# EAGLE design Adafruit DC Power BFF (EAGLE 9.6.2)
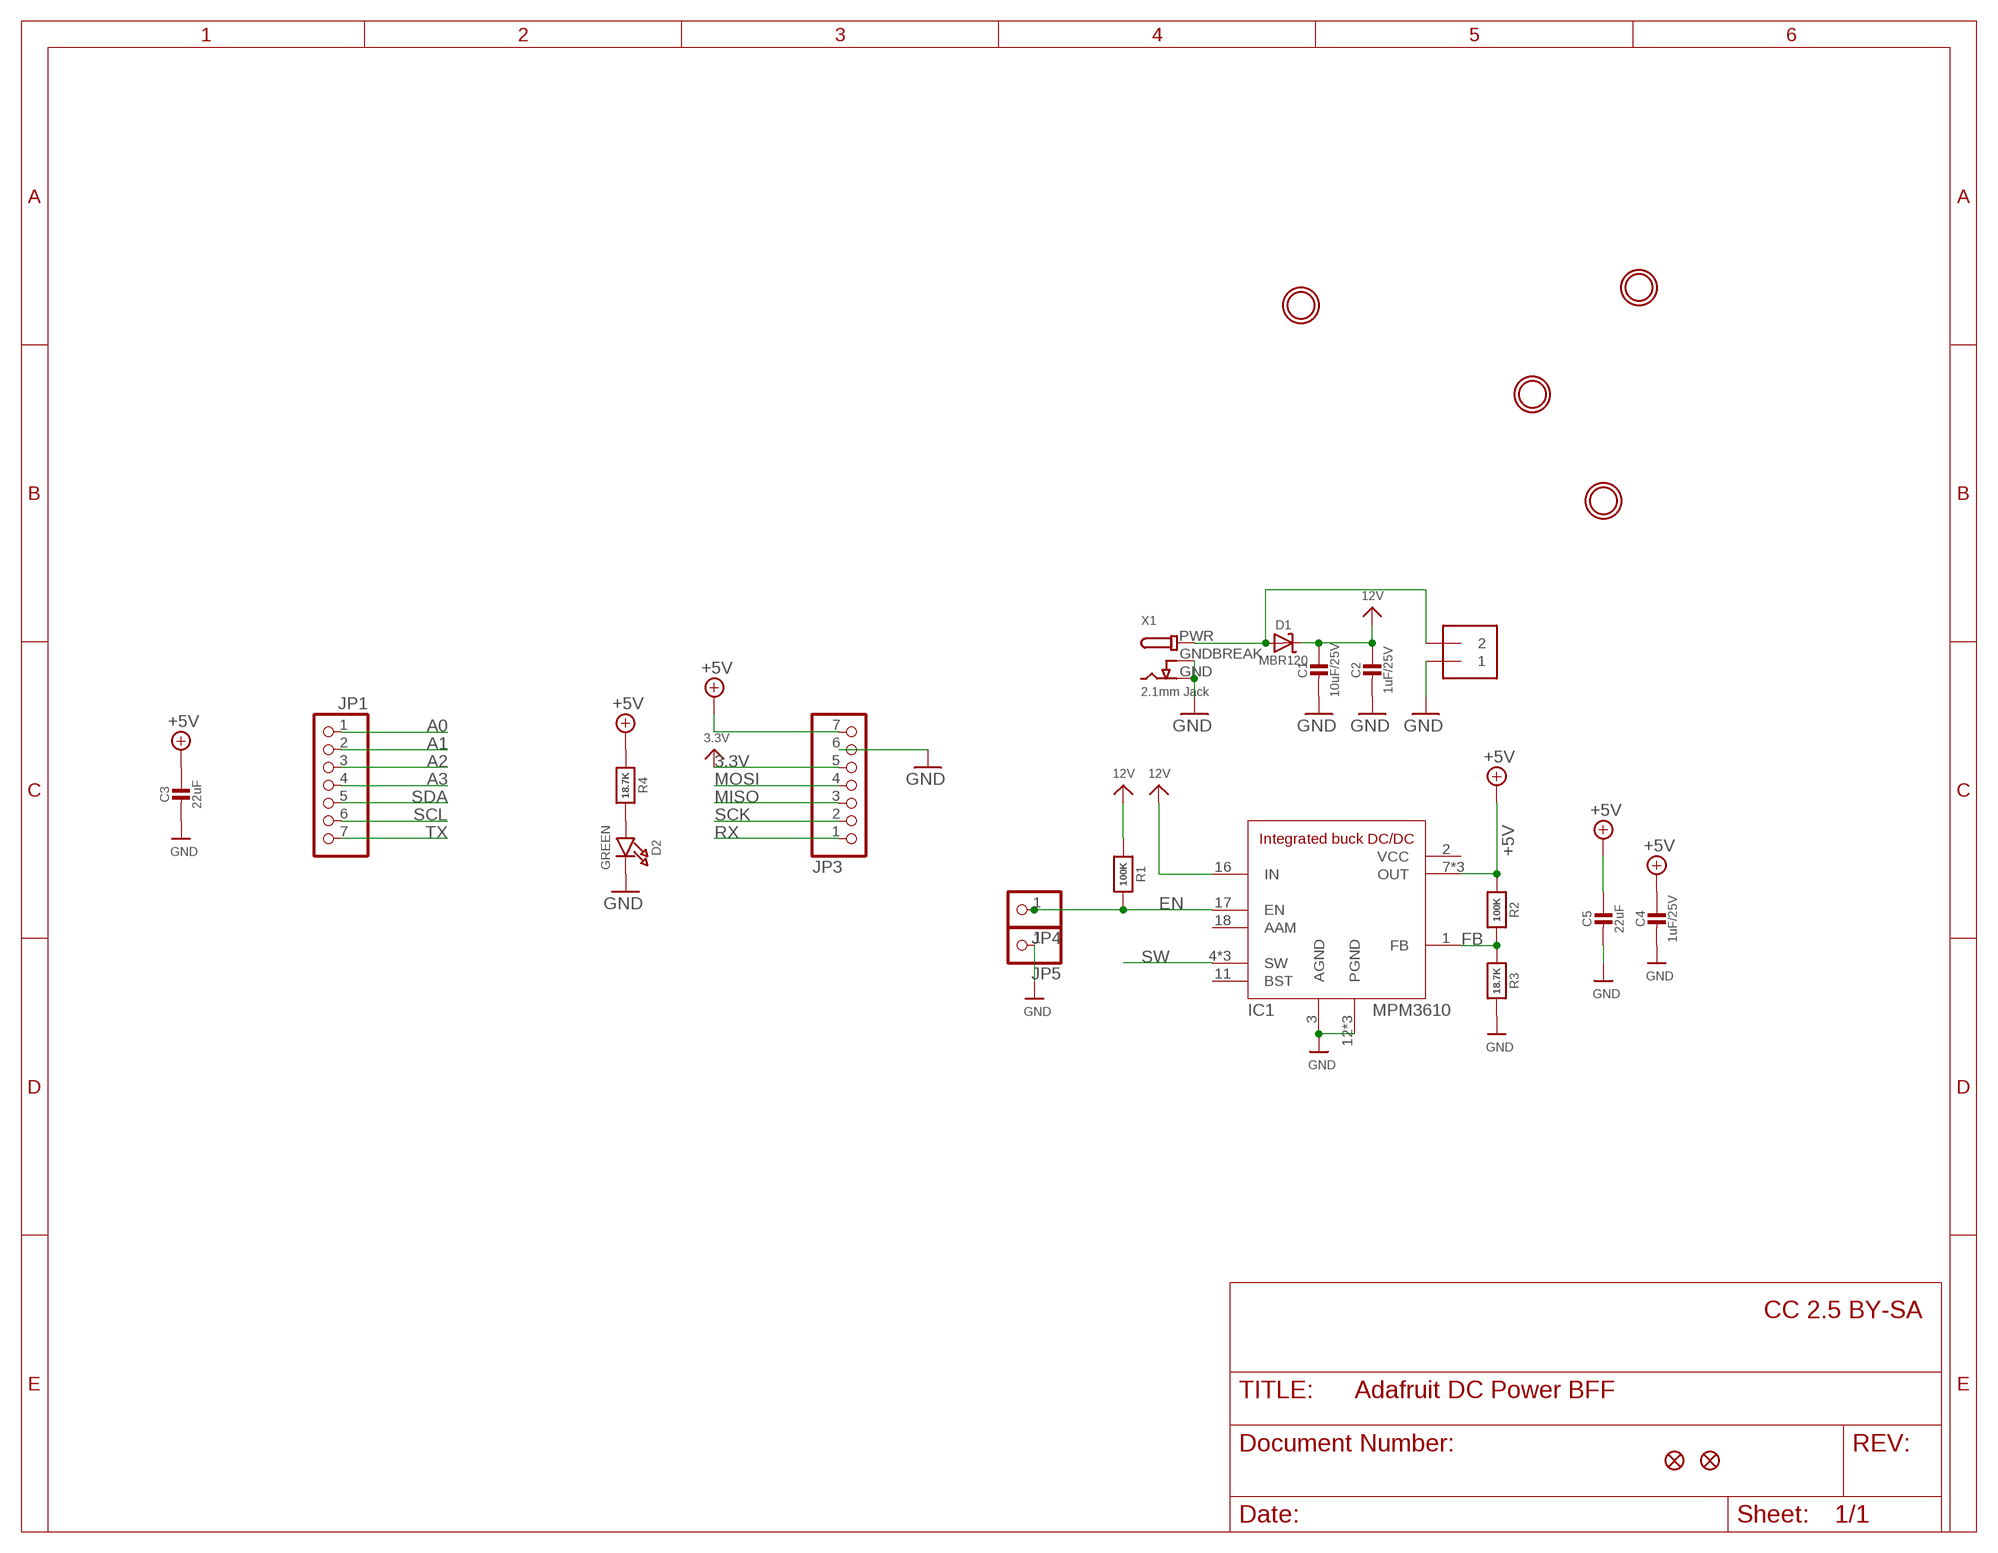
[diagram p0: schematic, sheet 1]

## Parts
C1  10uF/25V  CAP_CERAMIC0805-NOOUTLINE  [0805-NO]
C2  1uF/25V  CAP_CERAMIC0603_NO  [0603-NO]
C3  22uF  CAP_CERAMIC0805-NOOUTLINE  [0805-NO]
C4  1uF/25V  CAP_CERAMIC0603_NO  [0603-NO]
C5  22uF  CAP_CERAMIC0805-NOOUTLINE  [0805-NO]
D1  MBR120  DIODE-SCHOTTKYSOD-123FL  [SOD-123FL]
D2  GREEN  LED0603_NOOUTLINE  [CHIPLED_0603_NOOUTLINE]
IC1  MPM3610  [MPM3610]
J1  1X2-3.5MM  [1X2-3.5MM]
JP1  HEADER-1X7THICKER  [1X07_ROUND_76]
JP3  HEADER-1X7THICKER  [1X07_ROUND_76]
JP4  HEADER-1X12MM  [1X01_2MM]
JP5  HEADER-1X12MM  [1X01_2MM]
R1  100K  RESISTOR_0402NO  [_0402NO]
R2  100K  RESISTOR_0402NO  [_0402NO]
R3  18.7K  RESISTOR_0402NO  [_0402NO]
R4  18.7K  RESISTOR_0402NO  [_0402NO]
U$6  FIDUCIAL_1MM  [FIDUCIAL_1MM]
U$8  FIDUCIAL_1MM  [FIDUCIAL_1MM]
U$14  MOUNTINGHOLE2.5  [MOUNTINGHOLE_2.5_PLATED]
U$15  MOUNTINGHOLE2.5  [MOUNTINGHOLE_2.5_PLATED]
U$17  MOUNTINGHOLE2.5  [MOUNTINGHOLE_2.5_PLATED]
U$18  MOUNTINGHOLE2.5  [MOUNTINGHOLE_2.5_PLATED]
X1  2.1mm Jack  DCBARRELPTH  [DCJACK_2MM_PTH]

## Nets
3.3V: JP3.5
12V: C1.1 C2.1 D1.C IC1.16(IN) R1.1
+5V [power]: C3.1 C4.1 C5.1 IC1.7(OUT) IC1.8(OUT) IC1.9(OUT) JP3.7 R2.1 R4.1
A0: JP1.1
A1: JP1.2
A2: JP1.3
A3: JP1.4
EN: IC1.17(EN) JP4.1 R1.2
FB: IC1.1(FB) R2.2 R3.1
GND [power]: C1.2 C2.2 C3.2 C4.2 C5.2 D2.C IC1.3(AGND) IC1.12(PGND) IC1.13(PGND) IC1.14(PGND) J1.1 JP3.6 JP5.1 R3.2 X1.GND X1.GNDBREAK
MISO: JP3.3
MOSI: JP3.4
N$1: D2.A R4.2
N$2: D1.A J1.2 X1.PWR
RX: JP3.1
SCK: JP3.2
SCL: JP1.6
SDA: JP1.5
SW: IC1.4(SW) IC1.5(SW) IC1.6(SW)
TX: JP1.7
Unconnected: IC1.11(BST) IC1.18(AAM)

## Notes on the sheet
- CC 2.5 BY-SA

## Power pins joined to a net without a drawn wire
VCC: IC1.2(VCC)

## Library data of the parts
C1-C5 = microbuilder:CAP_CERAMIC: Ceramic Capacitors For new designs, use the packages preceded by an '_' character since they are more reliable: The following footprints should be used on most boards: _0402 - Standard footprint for regular board layouts _0603 - Standard footprint for regular board layouts _0805 - Standard footprint for regular board layouts _1206 - Standard footprint for regular board layouts For extremely tight-pitch boards where space is at a premium, the following 'micro-pitch' footprints can be used (smaller pads, no silkscreen outline, etc.): _0402MP - Micro-pitch footprint for very dense/compact boards _0603MP - Micro-pitch footprint for very dense/compact boards _0805MP - Micro-pitch footprint for very dense/compact boards _1206MP - Micro-pitch footprint for very dense/compact boards
D1 = microbuilder:DIODE-SCHOTTKY
D2 = microbuilder:LED: LED 0603 - 0603 Surface Mount Package 2mA: Green LED - Low Power (3.9mcd, 2ma, 1.7Vf) - Digikey: 475-2709-2-ND Orange LED - Low Power (9.8mcd, 2ma, 1.8Vf) - Digikey: 475-1194-2-ND Red LED - Low Power (5mcd, 2ma, 1.8Vf) - Digikey: 475-1195-2-ND Yellow LED - Low Power (7mcd, 2ma, 1.8Vf) - Digikey: 475-1196-2-ND 5mA: Blue LED - Low Power (17mcd, 5ma, 2.9Vf) - Digikey: LNJ937W8CRACT-ND 0805 - 0805 Surface Mount Package 2mA: Red LED (8.8mcd, 2mA, 1.8Vf, Clear) - Low Power [Digikey: 475-2510-1-ND] Green LED (5mcd, 2mA, 1.8Vf, Clear) - Low Power [Digikey: 475-2730-1-ND] Yellow LED (11.3mcd, 2mA, 1.8Vf, Clear) - Low Power [Digikey: 475-2555-1-ND] 20mA: Red LED (104mcd, 20mA, Diffused) - LS R976 [Digikey: 475-1278-6-ND] Red LED (12mcd, 20mA, 2.0Vf, Clear) - APT2012EC [Digikey: 754-1128-1-ND] Green LED (15mcd, 20mA, 2.2Vf, Clear) - APT2012GC [Digikey: 754-1131-1-ND] Orange LED (160mcd, 20mA, 2.1Vf, Clear) - APT2012SECK [Digikey: 754-1130-1-ND] 1206 - 1206 Surface Mount Package Green LED (26mcd, 20mA, Diffused) - LG N971 [Digikey: 475-1407-6-ND] Red LED (15mcd, 20mA, Diffused) - LH N974 [Digikey: 475-1416-6-ND] Cree - Cree High-Power Surface Mount LEDs XPEBWT-L1-0000-00D50 - White 111lm 350mA 2.9Vf 6200K 110° XTEAWT-00-0000-00000LEE3 - White 114lm 350mA 2.85Vf 5000K 115° Everlight - Everlight 45-21 Series Surface Mount LEDs 45-21/QK2C-B2832AC2CB2/2T - Warm White 2000mcd 20mA 3.25Vf 3050K 120° 45-21/LK2C-B38452C4CB2/2T - Nuetral White 2000mcd 20mA 3.25Vf 4150K 120° 45-21/LK2C-B50634C6CB2/2T - Cold White 2200mcd 20mA 3.25Vf 5650K 120° PLCC2 Reverse Mount LS T77K-J1L2-1-0-2-R18-Z - Red 11.25mcd 2mA 1.8Vf 630nm 120° LO T77K-L1M2-24-Z - Orange 19.6mcd 2mA 1.8Vf 606nm 120° LY T77K-K2M1-26-Z - Yellow 15.7mcd 2mA 1.8Vf 587nm 120°; ROT: 270
IC1 = microbuilder:MPM3610
J1 = adafruit:1X2: 3.5mm Terminal block http://www.ladyada.net/library/pcb/eaglelibrary.html
JP1 JP3 = adafruit_electromech:HEADER-1X7: PIN HEADER
JP4 JP5 = microbuilder:HEADER-1X1: PIN HEADER
R1-R4 = microbuilder:RESISTOR: Resistors For new designs, use the packages preceded by an '_' character since they are more reliable: The following footprints should be used on most boards: _0402 - Standard footprint for regular board layouts _0603 - Standard footprint for regular board layouts _0805 - Standard footprint for regular board layouts _1206 - Standard footprint for regular board layouts For extremely tight-pitch boards where space is at a premium, the following 'micro-pitch' footprints can be used (smaller pads, no silkscreen outline, etc.): _0402MP - Micro-pitch footprint for very dense/compact boards _0603MP - Micro-pitch footprint for very dense/compact boards _0805MP - Micro-pitch footprint for very dense/compact boards _1206MP - Micro-pitch footprint for very dense/compact boards
U$6 U$8 = microbuilder:FIDUCIAL: Fiducial Alignment Points Various fiducial points for machine vision alignment.; BOM: EXCLUDE
U$14 U$15 U$17 U$18 = adafruit_electromech:MOUNTINGHOLE: Mounting Hole For #2 screws (0.086"/2.18mm width, 0.094"/2.4mm hole) use 2.5mm; BOM: EXCLUDE
X1 = adafruit_electromech:DCBARREL: DC Barrel Jack DCJACK_1.3MM_PTH - Through Hole 1.3mm Jack (4UConnector: 05536) DCJACK_2MM_PTH - Through Hole 2.0/2.1 Jack (4UConnector: 05537) DCJACK_2MM_SMT - SMT 2.0/2.1mm Jack(4UConnector: 03267)

## Net classes
1 power: width 0.305 mm
2 thickpower: width 0.406 mm

## Board
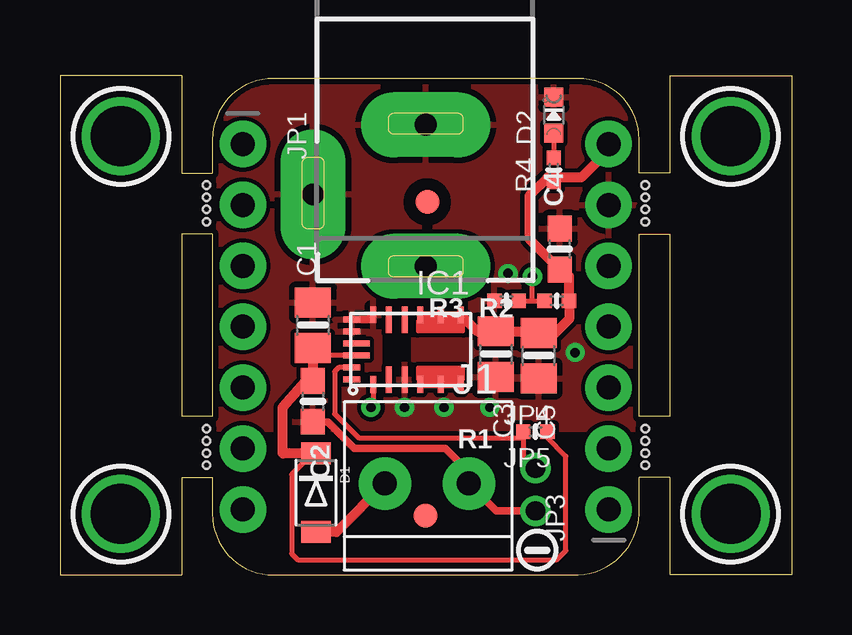
[diagram p1: board, top side]
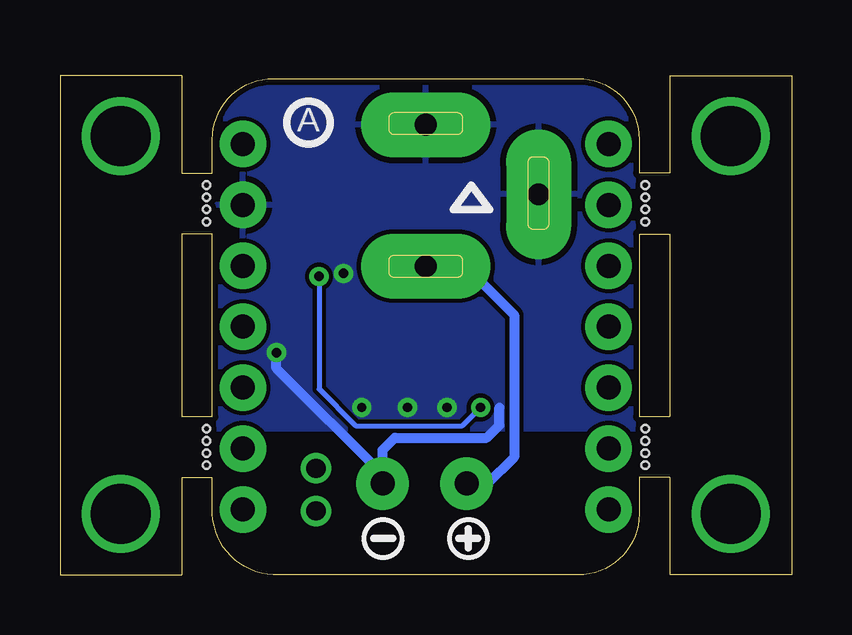
[diagram p2: board, bottom side, seen from below]

Size 30.48 x 20.83 mm. Coordinates in mm from the lower left corner, seen from the top.
Outline: 6.35,18.16 6.35,16.76 5.08,16.76 5.08,20.83 0,20.83 0,0 5.08,0 5.08,4.06 6.35,4.06 6.35,2.54 arc90 8.89,0 21.59,0 arc90 24.13,2.79 24.13,4.06 25.4,4.06 25.4,0 30.48,0 30.48,20.83 25.4,20.83 25.4,16.76 24.13,16.76 24.13,18.16 arc90 21.59,20.7 8.89,20.7 arc90 6.35,18.16
Outline: 6.35,14.22 6.35,6.6 5.08,6.6 5.08,14.22 6.35,14.22
Outline: 24.13,6.6 24.13,14.22 25.4,14.22 25.4,6.6 24.13,6.6
Copper layers (1*16): Top 0.035mm / dielectric 1.5mm / Bottom 0.035mm
Design rules "adafruit 7-7": minimum track width 7mil, minimum drill 15.5mil, track to track 7mil, track to pad 7mil, pad to pad 7mil, via to via 7mil, smd to smd 7mil, copper to edge 10mil, drill to drill 8mil, minimum pad ring 7mil, minimum via ring 8mil, stop-mask expansion 2mil, vias tented up to drill 20mil, thermal gap 10mil
Holes 0.3 mm at 6.1,14.73 6.1,15.24 6.1,15.75 6.1,16.26 6.1,4.57 6.1,5.08 6.1,5.59 6.1,6.1 24.38,14.73 24.38,15.24 24.38,15.75 24.38,16.26 24.38,4.57 24.38,5.08 24.38,5.59 24.38,6.1

### Footprints (pad centres in the part's own frame; a part is rotated, then mirrored left to right if it is on the bottom)
0805-NO = smd 1.24 x 1.5: 1 -0.95,0; 2 0.95,0
0603-NO = smd 1.075 x 1: 1 -0.85,0; 2 0.85,0
SOD-123FL = smd 0.91 x 1.22: A 1.637,0; C -1.637,0
CHIPLED_0603_NOOUTLINE = smd 0.8 x 0.8: A 0,-0.75; C 0,0.75
MPM3610 = smd 0.7 x 0.25: 1 -1.45,1.55; 4 -1.45,-0.4; 5 -1.45,-1.25; 6 -1.45,-2.1; 7 1.45,-2.1; 8 1.45,-1.25; 9 1.45,-0.4; 12 1.45,1.55 | smd 1.1 x 0.25: 2 -1.25,0.9; 3 -1.25,0.25; 10 1.25,0.25; 11 1.25,0.9 | smd 0.25 x 0.7: 13 1.25,2.45; 14 0.75,2.45; 17 -0.75,2.45; 18 -1.25,2.45 | smd 0.25 x 1.1: 15 0.25,2.25; 16 -0.25,2.25
1X2-3.5MM = drill 1 pad 2.184: 1 1.8,0; 2 -1.7,0
1X07_ROUND_76 = drill 1 pad 1.93: 1 -7.62,0; 2 -5.08,0; 3 -2.54,0; 4 0,0; 5 2.54,0; 6 5.08,0; 7 7.62,0
1X01_2MM = drill 0.8 pad 1.27: 1 0,0
_0402NO = smd 0.6 x 0.6: 1 -0.508,0; 2 0.508,0
FIDUCIAL_1MM = smd 1 x 1: 1 0,0
MOUNTINGHOLE_2.5_PLATED = drill 2.5 pad 3.2: P$1 0,0
DCJACK_2MM_PTH = drill 0.9 pad 2.7 long: GND -2.9,2.54; GNDBREAK 0,-2.16; PWR 3,2.54

### Placement (x,y rotation side)
C1  10.54,10.41 90 top
C2  10.54,7.24 270 top
C3  18.16,9.21 270 top
C4  20.83,13.59 90 top
C5  19.94,9.14 270 top
D1  10.67,3.43 270 top
D2  20.57,19.18 0 top
IC1  14.61,9.4 90 top
J1  15.24,3.81 0 top
JP1  7.62,10.35 270 top
JP3  22.86,10.35 90 top
JP4  19.81,4.45 0 top
JP5  19.81,2.67 0 top
PLABEL1  [PLABEL1]  9.14,2.54 90 top
PLABEL2  [PLABEL2]  9.14,5.21 90 top
PLABEL3  [PLABEL3]  22.16,19.68 0 top
PLABEL5  [PLABEL5]  9.14,12.7 90 top
PLABEL6  [PLABEL6]  8.64,19.56 0 top
PLABEL7  [PLABEL7]  9.14,10.67 90 top
PLABEL8  [PLABEL8]  20.83,15.56 90 top
PLABEL11  [PLABEL11]  21.21,7.81 90 top
PLABEL12  [PLABEL12]  9.14,8.13 90 top
PLABEL13  [PLABEL13]  21.21,5.27 90 top
PLABEL14  [PLABEL14]  21.21,2.73 90 top
PLABEL19  [PLABEL19]  17.02,15.88 0 bottom
PLABEL20  [PLABEL20]  10.67,0.64 0 top
PLABEL21  [PLABEL21]  14.73,8.38 0 bottom
R1  19.81,5.97 180 top
R2  20.7,11.43 180 top
R3  18.61,11.43 180 top
R4  20.57,16.89 90 top
U$3  [PCBFEAT-REV-040]  20.13,18.86 0 bottom
U$6  15.23,2.48 0 top
U$8  15.3,15.56 0 top
U$12  [SYMBOL_MINUS]  19.89,1.04 0 top
U$14  2.54,18.29 0 top
U$15  2.54,2.54 0 top
U$17  27.94,18.29 0 top
U$18  27.94,2.54 0 top
U$19  [SYMBOL_PLUS]  13.46,1.52 0 bottom
U$20  [SYMBOL_MINUS]  17.02,1.52 0 bottom
X1  12.7,15.88 270 top

### Tracks (layer width: path | path; a pad name or v marks a point on that pad's centre or on a via)
12V
  Top 0.203: IC1.16 10.79,9.15 10.54,9.4 | D1.C 10.53,5.07 9.65,4.19 9.65,0.89 9.91,0.64 20.7,0.64 21.08,1.02 21.08,4.95 20.32,5.71 R1.1
  Top 0.406: D1.C 9.28,5.07 9.27,5.08 9.27,6.99 10.54,8.4 C1.1 | C1.1 10.54,9.4 | C1.1 C2.1
+5V
  Top 0.305: IC1.9 IC1.8 IC1.7 | R4.1 20.77,16.57 21.08,16.57
  Top 0.406: IC1.7 17.4,10.16 C3.1 20,10.16 | 20,10.16 C5.1 | 20,10.16 20.13,10.03 20.57,10.03 21.21,10.67 R2.1 21.21,12.45 20.88,12.78 C4.1 19.56,14.01 19.56,15.81 20.32,16.57 21.08,16.57 21.72,16.57 22.86,17.72 JP3.7
EN
  Top 0.203: IC1.17 11.62,8.65 11.45,8.48 11.45,6.71 12.45,5.71 19.25,5.71 R1.2 19.3,4.95 JP4.1
FB  (via drill 0.39)
  Top 0.203: R3.1 19.69,11.43 | 19.69,11.43 R2.2 | 19.69,11.43 v19.69,12.45 | IC1.1 13.05,7.09 v12.95,6.99
  Bottom 0.203: v19.69,12.45 19.69,7.75 18.16,6.22 13.72,6.22 v12.95,6.99
GND  (via drill 0.39)
  Top 0.305: C2.2 11.16,6.39 12.27,5.28 16.05,5.28 17.04,4.3 J1.1 18.18,2.67 JP5.1 | IC1.12 12.86,10.65 IC1.13
  Bottom 0.406: 12.17,6.99 12.17,6.24 12.7,5.71 16.53,5.71 17.04,5.21 J1.1 17.04,4.19 21.46,8.61 v21.46,9.27
  other vias: 14.35,6.99 16,6.99 17.91,6.99 18.67,12.57
  pour Bottom: 24.13,20.7 6.35,20.7 6.35,6.1 24.13,6.1
  pour Top: 24.13,20.7 6.35,20.7 6.35,6.1 24.13,6.1
N$1
  Top 0.203: D2.A R4.2
N$2
  Top 0.406: J1.2 11.52,1.79 D1.A
  Bottom 0.406: X1.PWR 13.59,12.88 11.56,10.84 11.56,4.9 12.65,3.81 J1.2
SW
  Top 0.305: IC1.4 IC1.5 IC1.6

### Text on the board
Pinguin_tBackup: 5V | A0 | A1 | G | 3V | S | A2 | - | A3 | MO | + | MI | SDA | SCK | SCL | RX | Sig | TX | + | NeoPixel BFF
Pinguin_bBackup: USB | NeoPixel Driver / Neo+ <-> 5V / QT Py. Solder / back to back / Signal on A3 | Power BFF / 5~20V In / 5V @ 1.2A